# Altium project comp9.PrjPcb (part 1 of 2)
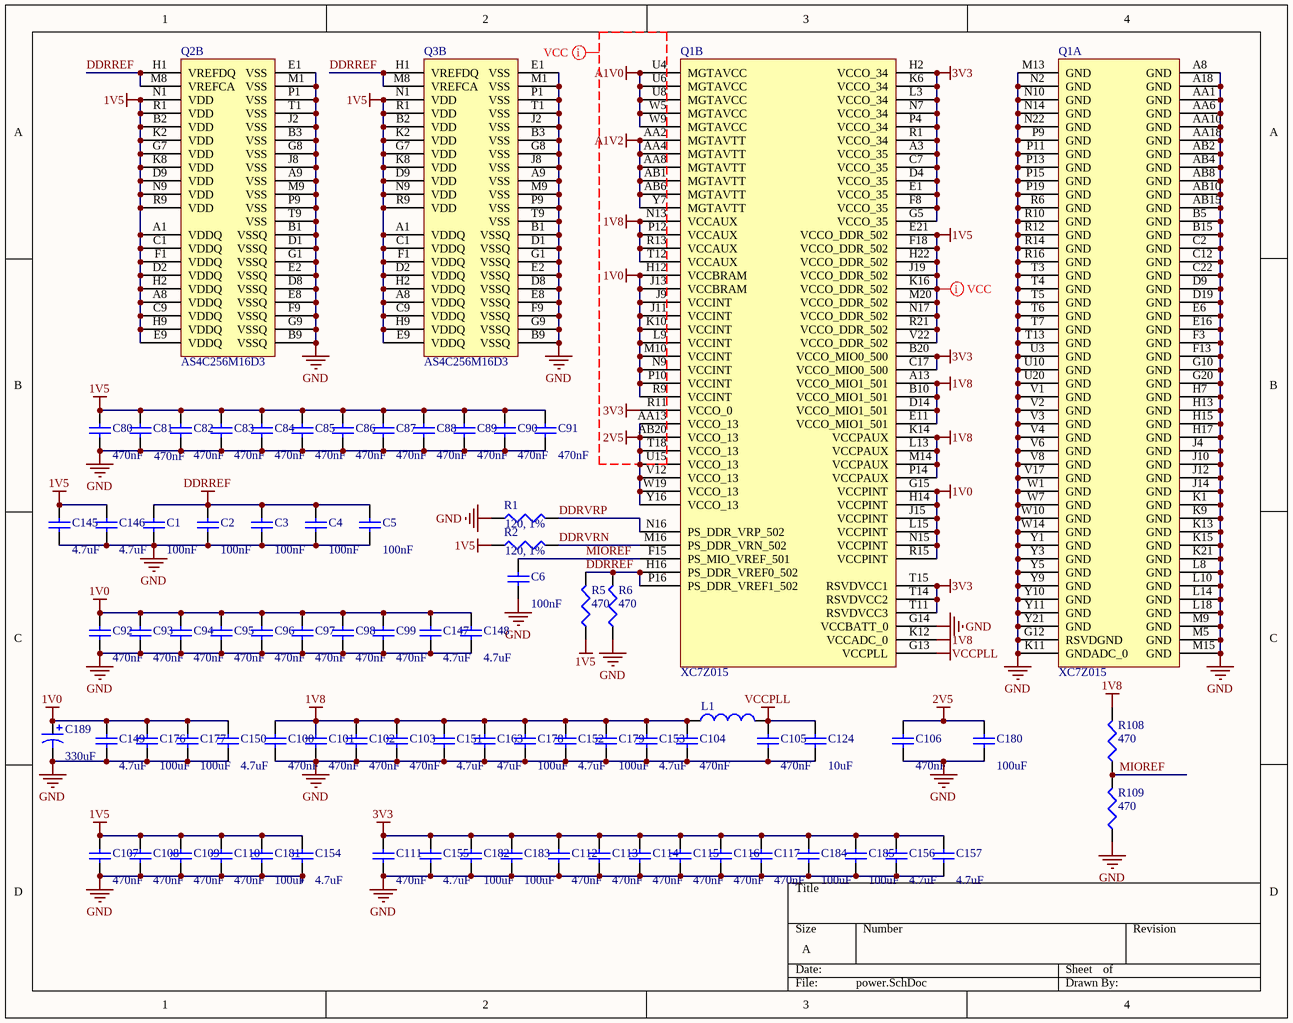
[diagram p0: power.SchDoc]
8 sheets, 479 parts. Net scope: global (net labels, ports and power ports of the same name join across sheets).
Board file: pcb.PcbDoc
Sheets:
  power.SchDoc
  misc.SchDoc
  mem.SchDoc
  conf.SchDoc
  ethusb.SchDoc
  gtp.SchDoc
  psu.SchDoc
  audio.SchDoc

## Sheet power.SchDoc
size A

### Parts
C1  value 100nF  [CAPC1005X06L]  (hidden comment: Cap)
C2  value 100nF  [CAPC1005X06L]  (hidden comment: Cap)
C3  value 100nF  [CAPC1005X06L]  (hidden comment: Cap)
C4  value 100nF  [CAPC1005X06L]  (hidden comment: Cap)
C5  value 100nF  [CAPC1005X06L]  (hidden comment: Cap)
C6  value 100nF  [CAPC1005X06L]  (hidden comment: Cap)
C80  value 470nF  [CAPC1005X06L]  (hidden comment: JMK105BJ474KV-F)
C81  value 470nF  [CAPC1005X06L]  (hidden comment: JMK105BJ474KV-F)
C82  value 470nF  [CAPC1005X06L]  (hidden comment: JMK105BJ474KV-F)
C83  value 470nF  [CAPC1005X06L]  (hidden comment: JMK105BJ474KV-F)
C84  value 470nF  [CAPC1005X06L]  (hidden comment: JMK105BJ474KV-F)
C85  value 470nF  [CAPC1005X06L]  (hidden comment: JMK105BJ474KV-F)
C86  value 470nF  [CAPC1005X06L]  (hidden comment: JMK105BJ474KV-F)
C87  value 470nF  [CAPC1005X06L]  (hidden comment: JMK105BJ474KV-F)
C88  value 470nF  [CAPC1005X06L]  (hidden comment: JMK105BJ474KV-F)
C89  value 470nF  [CAPC1005X06L]  (hidden comment: JMK105BJ474KV-F)
C90  value 470nF  [CAPC1005X06L]  (hidden comment: JMK105BJ474KV-F)
C91  value 470nF  [CAPC1005X06L]  (hidden comment: JMK105BJ474KV-F)
C92  value 470nF  [CAPC1005X06L]  (hidden comment: JMK105BJ474KV-F)
C93  value 470nF  [CAPC1005X06L]  (hidden comment: JMK105BJ474KV-F)
C94  value 470nF  [CAPC1005X06L]  (hidden comment: JMK105BJ474KV-F)
C95  value 470nF  [CAPC1005X06L]  (hidden comment: JMK105BJ474KV-F)
C96  value 470nF  [CAPC1005X06L]  (hidden comment: JMK105BJ474KV-F)
C97  value 470nF  [CAPC1005X06L]  (hidden comment: JMK105BJ474KV-F)
C98  value 470nF  [CAPC1005X06L]  (hidden comment: JMK105BJ474KV-F)
C99  value 470nF  [CAPC1005X06L]  (hidden comment: JMK105BJ474KV-F)
C100  value 470nF  [CAPC1005X06L]  (hidden comment: JMK105BJ474KV-F)
C101  value 470nF  [CAPC1005X06L]  (hidden comment: JMK105BJ474KV-F)
C102  value 470nF  [CAPC1005X06L]  (hidden comment: JMK105BJ474KV-F)
C103  value 470nF  [CAPC1005X06L]  (hidden comment: JMK105BJ474KV-F)
C104  value 470nF  [CAPC1005X06L]  (hidden comment: JMK105BJ474KV-F)
C105  value 470nF  [CAPC1005X06L]  (hidden comment: JMK105BJ474KV-F)
C106  value 470nF  [CAPC1005X06L]  (hidden comment: JMK105BJ474KV-F)
C107  value 470nF  [CAPC1005X06L]  (hidden comment: JMK105BJ474KV-F)
C108  value 470nF  [CAPC1005X06L]  (hidden comment: JMK105BJ474KV-F)
C109  value 470nF  [CAPC1005X06L]  (hidden comment: JMK105BJ474KV-F)
C110  value 470nF  [CAPC1005X06L]  (hidden comment: JMK105BJ474KV-F)
C111  value 470nF  [CAPC1005X06L]  (hidden comment: JMK105BJ474KV-F)
C112  value 470nF  [CAPC1005X06L]  (hidden comment: JMK105BJ474KV-F)
C113  value 470nF  [CAPC1005X06L]  (hidden comment: JMK105BJ474KV-F)
C114  value 470nF  [CAPC1005X06L]  (hidden comment: JMK105BJ474KV-F)
C115  value 470nF  [CAPC1005X06L]  (hidden comment: JMK105BJ474KV-F)
C116  value 470nF  [CAPC1005X06L]  (hidden comment: JMK105BJ474KV-F)
C117  value 470nF  [CAPC1005X06L]  (hidden comment: JMK105BJ474KV-F)
C124  value 10uF  [CAPC1608X90N]  (hidden comment: GRM188R60G106ME47)
C145  value 4.7uF  [CAPC1608X90N]  (hidden comment: GRM188R60J475ME19D)
C146  value 4.7uF  [CAPC1608X90N]  (hidden comment: GRM188R60J475ME19D)
C147  value 4.7uF  [CAPC1608X90N]  (hidden comment: GRM188R60J475ME19D)
C148  value 4.7uF  [CAPC1608X90N]  (hidden comment: GRM188R60J475ME19D)
C149  value 4.7uF  [CAPC1608X90N]  (hidden comment: GRM188R60J475ME19D)
C150  value 4.7uF  [CAPC1608X90N]  (hidden comment: GRM188R60J475ME19D)
C151  value 4.7uF  [CAPC1608X90N]  (hidden comment: GRM188R60J475ME19D)
C152  value 4.7uF  [CAPC1608X90N]  (hidden comment: GRM188R60J475ME19D)
C153  value 4.7uF  [CAPC1608X90N]  (hidden comment: GRM188R60J475ME19D)
C154  value 4.7uF  [CAPC1608X90N]  (hidden comment: GRM188R60J475ME19D)
C155  value 4.7uF  [CAPC1608X90N]  (hidden comment: GRM188R60J475ME19D)
C156  value 4.7uF  [CAPC1608X90N]  (hidden comment: GRM188R60J475ME19D)
C157  value 4.7uF  [CAPC1608X90N]  (hidden comment: GRM188R60J475ME19D)
C163  value 47uF  [CAPC3225X220N]  (hidden comment: GRM31CR60J476ME19L)
C176  value 100uF  [CAPC3225X220N]  (hidden comment: GRM31CR60J107ME39L)
C177  value 100uF  [CAPC3225X220N]  (hidden comment: GRM31CR60J107ME39L)
C178  value 100uF  [CAPC3225X220N]  (hidden comment: GRM31CR60J107ME39L)
C179  value 100uF  [CAPC3225X220N]  (hidden comment: GRM31CR60J107ME39L)
C180  value 100uF  [CAPC3225X220N]  (hidden comment: GRM31CR60J107ME39L)
C181  value 100uF  [CAPC3225X220N]  (hidden comment: GRM31CR60J107ME39L)
C182  value 100uF  [CAPC3225X220N]  (hidden comment: GRM31CR60J107ME39L)
C183  value 100uF  [CAPC3225X220N]  (hidden comment: GRM31CR60J107ME39L)
C184  value 100uF  [CAPC3225X220N]  (hidden comment: GRM31CR60J107ME39L)
C185  value 100uF  [CAPC3225X220N]  (hidden comment: GRM31CR60J107ME39L)
C189  value 330uF  [CAP-D/7343-31]  (hidden comment: T520D337M006ATE018)
L1  BLM18SG121TN1  [CAPC1608X90N]  (value not drawn)
Q1  XC7Z015  [BGA484x22]  (parts A,B of 9)
Q2  AS4C256M16D3  [DDR3]  (part B of 2)
Q3  AS4C256M16D3  [DDR3]  (part B of 2)
R1  value 120, 1%  [CAPC1005X06L]  (hidden comment: RC1005F121CS)
R2  value 120, 1%  [CAPC1005X06L]  (hidden comment: RC1005F121CS)
R5  value 470  [J1-0603]  (hidden comment: RC1608F471CS)
R6  value 470  [J1-0603]  (hidden comment: RC1608F471CS)
R108  value 470  [CAPC1005X06L]  (hidden comment: RC1005F471CS)
R109  value 470  [CAPC1005X06L]  (hidden comment: RC1005F471CS)

### Nets
1V0: C92.2 C93.2 C94.2 C95.2 C96.2 C97.2 C98.2 C99.2 C147.2 C148.2 C149.2 C150.2 C176.2 C177.2 C189.1 Q1.G15(VCCPINT) Q1.H12(VCCBRAM) Q1.H14(VCCPINT) Q1.J9(VCCINT) Q1.J11(VCCINT) Q1.J13(VCCBRAM) Q1.J15(VCCPINT) Q1.K10(VCCINT) Q1.L9(VCCINT) Q1.L15(VCCPINT) Q1.M10(VCCINT) Q1.N9(VCCINT) Q1.N15(VCCPINT) Q1.P10(VCCINT) Q1.R9(VCCINT) Q1.R15(VCCPINT)
1V5: C80.2 C81.2 C82.2 C83.2 C84.2 C85.2 C86.2 C87.2 C88.2 C89.2 C90.2 C91.2 C107.2 C108.2 C109.2 C110.2 C145.2 C146.2 C154.2 C181.2 Q1.E21(VCCO_DDR_502) Q1.F18(VCCO_DDR_502) Q1.H22(VCCO_DDR_502) Q1.J19(VCCO_DDR_502) Q1.K16(VCCO_DDR_502) Q1.M20(VCCO_DDR_502) Q1.N17(VCCO_DDR_502) Q1.R21(VCCO_DDR_502) Q1.V22(VCCO_DDR_502) Q2.A1(VDDQ) Q2.A8(VDDQ) Q2.B2(VDD) Q2.C1(VDDQ) Q2.C9(VDDQ) Q2.D2(VDDQ) Q2.D9(VDD) Q2.E9(VDDQ) Q2.F1(VDDQ) Q2.G7(VDD) Q2.H2(VDDQ) Q2.H9(VDDQ) Q2.K2(VDD) Q2.K8(VDD) Q2.N1(VDD) Q2.N9(VDD) Q2.R1(VDD) Q2.R9(VDD) Q3.A1(VDDQ) Q3.A8(VDDQ) Q3.B2(VDD) Q3.C1(VDDQ) Q3.C9(VDDQ) Q3.D2(VDDQ) Q3.D9(VDD) Q3.E9(VDDQ) Q3.F1(VDDQ) Q3.G7(VDD) Q3.H2(VDDQ) Q3.H9(VDDQ) Q3.K2(VDD) Q3.K8(VDD) Q3.N1(VDD) Q3.N9(VDD) Q3.R1(VDD) Q3.R9(VDD) R2.1 R5.1
1V8: C100.2 C101.2 C102.2 C103.2 C104.2 C151.2 C152.2 C153.2 C163.2 C178.2 C179.2 L1.1 Q1.A13(VCCO_MIO1_501) Q1.B10(VCCO_MIO1_501) Q1.D14(VCCO_MIO1_501) Q1.E11(VCCO_MIO1_501) Q1.K12(VCCADC_0) Q1.K14(VCCPAUX) Q1.L13(VCCPAUX) Q1.M14(VCCPAUX) Q1.N13(VCCAUX) Q1.P12(VCCAUX) Q1.P14(VCCPAUX) Q1.R13(VCCAUX) Q1.T12(VCCAUX) R108.2
2V5: C106.2 C180.2 Q1.AA13(VCCO_13) Q1.AB20(VCCO_13) Q1.T18(VCCO_13) Q1.U15(VCCO_13) Q1.V12(VCCO_13) Q1.W19(VCCO_13) Q1.Y16(VCCO_13)
3V3: C111.2 C112.2 C113.2 C114.2 C115.2 C116.2 C117.2 C155.2 C156.2 C157.2 C182.2 C183.2 C184.2 C185.2 Q1.A3(VCCO_35) Q1.B20(VCCO_MIO0_500) Q1.C7(VCCO_35) Q1.C17(VCCO_MIO0_500) Q1.D4(VCCO_35) Q1.E1(VCCO_35) Q1.F8(VCCO_35) Q1.G5(VCCO_35) Q1.H2(VCCO_34) Q1.K6(VCCO_34) Q1.L3(VCCO_34) Q1.N7(VCCO_34) Q1.P4(VCCO_34) Q1.R1(VCCO_34) Q1.R11(VCCO_0) Q1.T11(RSVDVCC3) Q1.T14(RSVDVCC2) Q1.T15(RSVDVCC1)
A1V0: Q1.U4(MGTAVCC) Q1.U6(MGTAVCC) Q1.U8(MGTAVCC) Q1.W5(MGTAVCC) Q1.W9(MGTAVCC)
A1V2: Q1.AA2(MGTAVTT) Q1.AA4(MGTAVTT) Q1.AA8(MGTAVTT) Q1.AB1(MGTAVTT) Q1.AB6(MGTAVTT) Q1.Y7(MGTAVTT)
DDRREF: C1.2 C2.2 C3.2 C4.2 C5.2 Q1.H16(PS_DDR_VREF0_502) Q1.P16(PS_DDR_VREF1_502) Q2.H1(VREFDQ) Q2.M8(VREFCA) Q3.H1(VREFDQ) Q3.M8(VREFCA) R5.2 R6.2
GND: C1.1 C2.1 C3.1 C4.1 C5.1 C6.1 C80.1 C81.1 C82.1 C83.1 C84.1 C85.1 C86.1 C87.1 C88.1 C89.1 C90.1 C91.1 C92.1 C93.1 C94.1 C95.1 C96.1 C97.1 C98.1 C99.1 C100.1 C101.1 C102.1 C103.1 C104.1 C105.1 C106.1 C107.1 C108.1 C109.1 C110.1 C111.1 C112.1 C113.1 C114.1 C115.1 C116.1 C117.1 C124.1 C145.1 C146.1 C147.1 C148.1 C149.1 C150.1 C151.1 C152.1 C153.1 C154.1 C155.1 C156.1 C157.1 C163.1 C176.1 C177.1 C178.1 C179.1 C180.1 C181.1 C182.1 C183.1 C184.1 C185.1 C189.2 Q1.A8(GND) Q1.A18(GND) Q1.AA1(GND) Q1.AA6(GND) Q1.AA10(GND) Q1.AA18(GND) Q1.AB2(GND) Q1.AB4(GND) Q1.AB8(GND) Q1.AB10(GND) Q1.AB15(GND) Q1.B5(GND) Q1.B15(GND) Q1.C2(GND) Q1.C12(GND) Q1.C22(GND) Q1.D9(GND) Q1.D19(GND) Q1.E6(GND) Q1.E16(GND) Q1.F3(GND) Q1.F13(GND) Q1.G10(GND) Q1.G12(RSVDGND) Q1.G14(VCCBATT_0) Q1.G20(GND) Q1.H7(GND) Q1.H13(GND) Q1.H15(GND) Q1.H17(GND) Q1.J4(GND) Q1.J10(GND) Q1.J12(GND) Q1.J14(GND) Q1.K1(GND) Q1.K9(GND) Q1.K11(GNDADC_0) Q1.K13(GND) Q1.K15(GND) Q1.K21(GND) Q1.L8(GND) Q1.L10(GND) Q1.L14(GND) Q1.L18(GND) Q1.M5(GND) Q1.M9(GND) Q1.M13(GND) Q1.M15(GND) Q1.N2(GND) Q1.N10(GND) Q1.N14(GND) Q1.N22(GND) Q1.P9(GND) Q1.P11(GND) Q1.P13(GND) Q1.P15(GND) Q1.P19(GND) Q1.R6(GND) Q1.R10(GND) Q1.R12(GND) Q1.R14(GND) Q1.R16(GND) Q1.T3(GND) Q1.T4(GND) Q1.T5(GND) Q1.T6(GND) Q1.T7(GND) Q1.T13(GND) Q1.U3(GND) Q1.U10(GND) Q1.U20(GND) Q1.V1(GND) Q1.V2(GND) Q1.V3(GND) Q1.V4(GND) Q1.V6(GND) Q1.V8(GND) Q1.V17(GND) Q1.W1(GND) Q1.W7(GND) Q1.W10(GND) Q1.W14(GND) Q1.Y1(GND) Q1.Y3(GND) Q1.Y5(GND) Q1.Y9(GND) Q1.Y10(GND) Q1.Y11(GND) Q1.Y21(GND) Q2.A9(VSS) Q2.B1(VSSQ) Q2.B3(VSS) Q2.B9(VSSQ) Q2.D1(VSSQ) Q2.D8(VSSQ) Q2.E1(VSS) Q2.E2(VSSQ) Q2.E8(VSSQ) Q2.F9(VSSQ) Q2.G1(VSSQ) Q2.G8(VSS) Q2.G9(VSSQ) Q2.J2(VSS) Q2.J8(VSS) Q2.M1(VSS) Q2.M9(VSS) Q2.P1(VSS) Q2.P9(VSS) Q2.T1(VSS) Q2.T9(VSS) Q3.A9(VSS) Q3.B1(VSSQ) Q3.B3(VSS) Q3.B9(VSSQ) Q3.D1(VSSQ) Q3.D8(VSSQ) Q3.E1(VSS) Q3.E2(VSSQ) Q3.E8(VSSQ) Q3.F9(VSSQ) Q3.G1(VSSQ) Q3.G8(VSS) Q3.G9(VSSQ) Q3.J2(VSS) Q3.J8(VSS) Q3.M1(VSS) Q3.M9(VSS) Q3.P1(VSS) Q3.P9(VSS) Q3.T1(VSS) Q3.T9(VSS) R1.1 R6.1 R109.1
VCCPLL: C105.2 C124.2 L1.2 Q1.G13(VCCPLL)
DDRVRN: Q1.M16(PS_DDR_VRN_502) R2.2
DDRVRP: Q1.N16(PS_DDR_VRP_502) R1.2
MIOREF: C6.2 Q1.F15(PS_MIO_VREF_501) R108.1 R109.2

### Layout directives
net class VCC: 1V0, 1V5, 1V8, 2V5, 3V3, A1V0, A1V2

### Library data of the parts
C1-C6 C80-C117 C124 C145-C157 C163 C176-C185 = Cap: Capacitor; Published: 8-Jun-2000; LatestRevisionDate: 17-Jul-2002; LatestRevisionNote: Re-released for DXP Platform.; PackageReference: RAD-0.3; Publisher: Altium Limited; PackageDescription: Radial Cap, Thru-Hole; 2 Leads; 0.3 in Pin Spacing; Supplier 1: Digi-Key
  C1-C6: Supplier Part Number 1: 1276-1443-1-ND
  C80-C117: Supplier Part Number 1: 587-1230-1-ND
  C124: Supplier Part Number 1: 490-3298-1-ND
  C145-C157: Supplier Part Number 1: 490-5421-1-ND
  C163: Supplier Part Number 1: 490-3907-1-ND
  C176-C185: Supplier Part Number 1: 490-4539-1-ND
C189 = Cap Pol1: Polarized Capacitor (Radial); Published: 8-Jun-2000; LatestRevisionDate: 17-Jul-2002; LatestRevisionNote: Re-released for DXP Platform.; PackageReference: RB7.6-15; Publisher: Altium Limited; PackageDescription: Polarized Capacitor (Radial); 2 Leads; Supplier 1: Digi-Key; Supplier Part Number 1: 399-5149-1-ND
L1 = Inductor: Code_IEC: 1005; Value: 10mH; Published: 8-Jun-2000; LatestRevisionDate: 29-May-2009; LatestRevisionNote: IPC-7351 Footprint Added.; PackageReference: 0402-A; Publisher: Altium Limited; PackageDescription: Chip Inductor; Code_JEITA: 0402; Supplier 1: Digi-Key; Supplier Part Number 1: 490-3996-1-ND
R1 R2 R5 R6 R108 R109 = Res3: Resistor; Published: 8-Jun-2000; LatestRevisionDate: 29-May-2009; LatestRevisionNote: IPC-7351 Footprint Added.; PackageReference: J1-0603; Publisher: Altium Limited; PackageDescription: Chip Resistor; Supplier 1: Digi-Key
  R1 R2: Supplier Part Number 1: 1276-3947-1-ND
  R5 R6: Supplier Part Number 1: 1276-4619-1-ND
  R108 R109: Supplier Part Number 1: 1276-3989-1-ND
Q1 = XC7Z015: Supplier 1: Digi-Key; Supplier Part Number 1: 122-1905-ND
Q2 Q3 = AS4C256M16D3: Supplier 1: Digi-Key; Supplier Part Number 1: 1450-1095-ND

## Sheet misc.SchDoc
size A
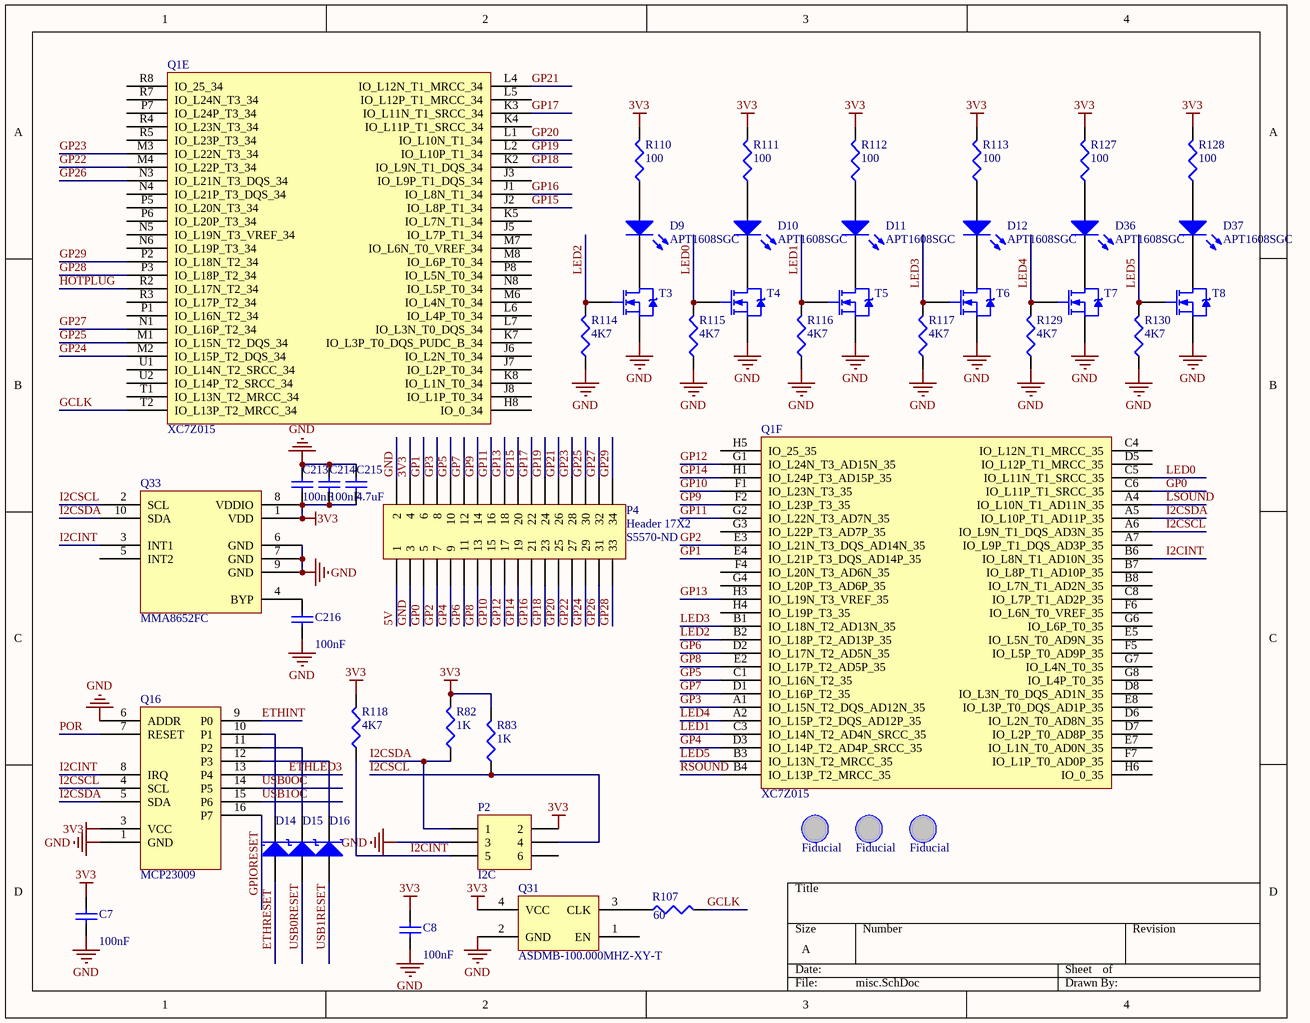
[diagram p1: misc.SchDoc]

### Parts
C7  value 100nF  [CAPC1005X06L]  (hidden comment: Cap)
C8  value 100nF  [CAPC1005X06L]  (hidden comment: Cap)
C213  value 100nF  [CAPC1005X06L]  (hidden comment: Cap)
C214  value 100nF  [CAPC1005X06L]  (hidden comment: Cap)
C215  value 4.7uF  [CAPC1608X90N]  (hidden comment: GRM188R60J475ME19D)
C216  value 100nF  [CAPC1005X06L]  (hidden comment: Cap)
D9  APT1608SGC  [LED-0603]
D10  APT1608SGC  [LED-0603]
D11  APT1608SGC  [LED-0603]
D12  APT1608SGC  [LED-0603]
D14  BAT54FSCT-ND  [BAT54]  (value not drawn)
D15  BAT54FSCT-ND  [BAT54]  (value not drawn)
D16  BAT54FSCT-ND  [BAT54]  (value not drawn)
D36  APT1608SGC  [LED-0603]
D37  APT1608SGC  [LED-0603]
FIDU1  Fiducial  [FIDU]  (no BOM)
FIDU2  Fiducial  [FIDU]  (no BOM)
FIDU3  Fiducial  [FIDU]  (no BOM)
P2  I2C  [HDR2X3]
P4  Header 17X2  Supplier Part Number 1: S5570-ND  [HDR2X17]
Q1  XC7Z015  [BGA484x22]  (parts E,F of 9)
Q16  MCP23009  [MCP23009]
Q31  ASDMB-100.000MHZ-XY-T  [ASDMB]
Q33  MMA8652FC  [MMA8653FC]
R82  value 1K  [J1-0603]  (hidden comment: RC1608J102CS)
R83  value 1K  [J1-0603]  (hidden comment: RC1608J102CS)
R107  value 60  [J1-0603]  (hidden comment: RC1608F60R4CS)
R110  value 100  [J1-0603]  (hidden comment: RC1608F101CS)
R111  value 100  [J1-0603]  (hidden comment: RC1608F101CS)
R112  value 100  [J1-0603]  (hidden comment: RC1608F101CS)
R113  value 100  [J1-0603]  (hidden comment: RC1608F101CS)
R114  value 4K7  [J1-0603]  (hidden comment: RC1608J472CS)
R115  value 4K7  [J1-0603]  (hidden comment: RC1608J472CS)
R116  value 4K7  [J1-0603]  (hidden comment: RC1608J472CS)
R117  value 4K7  [J1-0603]  (hidden comment: RC1608J472CS)
R118  value 4K7  [J1-0603]  (hidden comment: RC1608J472CS)
R127  value 100  [J1-0603]  (hidden comment: RC1608F101CS)
R128  value 100  [J1-0603]  (hidden comment: RC1608F101CS)
R129  value 4K7  [J1-0603]  (hidden comment: RC1608J472CS)
R130  value 4K7  [J1-0603]  (hidden comment: RC1608J472CS)
T3  (no value)  [EMT3F]
T4  (no value)  [EMT3F]
T5  (no value)  [EMT3F]
T6  (no value)  [EMT3F]
T7  (no value)  [EMT3F]
T8  (no value)  [EMT3F]

### Nets
3V3: C7.2 C8.2 C213.2 C214.1 C215.1 P2.2 P4.4 Q16.3(VCC) Q31.4(VCC) Q33.1(VDD) Q33.8(VDDIO) R82.2 R83.2 R110.2 R111.2 R112.2 R113.2 R118.2 R127.2 R128.2
5V: P4.1
GND: C7.1 C8.1 C213.1 C214.2 C215.2 C216.1 P2.3 P4.2 P4.3 Q16.1(GND) Q16.6(ADDR) Q31.2(GND) Q33.6(GND) Q33.7(GND) Q33.9(GND) R114.1 R115.1 R116.1 R117.1 R129.1 R130.1 T3.2(S) T4.2(S) T5.2(S) T6.2(S) T7.2(S) T8.2(S)
ETHINT: Q16.9(P0)
ETHLED3: Q16.13(P4)
ETHRESET: D14.1(A)
GCLK: Q1.T2(IO_L13P_T2_MRCC_34) R107.2
GP0: P4.5 Q1.C6(IO_L11P_T1_SRCC_35)
GP1: P4.6 Q1.E4(IO_L21P_T3_DQS_AD14P_35)
GP2: P4.7 Q1.E3(IO_L21N_T3_DQS_AD14N_35)
GP3: P4.8 Q1.A1(IO_L15N_T2_DQS_AD12N_35)
GP4: P4.9 Q1.D3(IO_L14P_T2_AD4P_SRCC_35)
GP5: P4.10 Q1.C1(IO_L16N_T2_35)
GP6: P4.11 Q1.D2(IO_L17N_T2_AD5N_35)
GP7: P4.12 Q1.D1(IO_L16P_T2_35)
GP8: P4.13 Q1.E2(IO_L17P_T2_AD5P_35)
GP9: P4.14 Q1.F2(IO_L23P_T3_35)
GP10: P4.15 Q1.F1(IO_L23N_T3_35)
GP11: P4.16 Q1.G2(IO_L22N_T3_AD7N_35)
GP12: P4.17 Q1.G1(IO_L24N_T3_AD15N_35)
GP13: P4.18 Q1.H3(IO_L19N_T3_VREF_35)
GP14: P4.19 Q1.H1(IO_L24P_T3_AD15P_35)
GP15: P4.20 Q1.J2(IO_L8P_T1_34)
GP16: P4.21 Q1.J1(IO_L8N_T1_34)
GP17: P4.22 Q1.K3(IO_L11N_T1_SRCC_34)
GP18: P4.23 Q1.K2(IO_L9N_T1_DQS_34)
GP19: P4.24 Q1.L2(IO_L10P_T1_34)
GP20: P4.25 Q1.L1(IO_L10N_T1_34)
GP21: P4.26 Q1.L4(IO_L12N_T1_MRCC_34)
GP22: P4.27 Q1.M4(IO_L22P_T3_34)
GP23: P4.28 Q1.M3(IO_L22N_T3_34)
GP24: P4.29 Q1.M2(IO_L15P_T2_DQS_34)
GP25: P4.30 Q1.M1(IO_L15N_T2_DQS_34)
GP26: P4.31 Q1.N3(IO_L21N_T3_DQS_34)
GP27: P4.32 Q1.N1(IO_L16P_T2_34)
GP28: P4.33 Q1.P3(IO_L18P_T2_34)
GP29: P4.34 Q1.P2(IO_L18N_T2_34)
GPIORESET: Q16.16(P7)
HOTPLUG: Q1.R2(IO_L17N_T2_34)
I2CINT: P2.5 Q1.B6(IO_L8N_T1_AD10N_35) Q16.8(IRQ) Q33.3(INT1) R118.1
I2CSCL: P2.4 Q1.A6(IO_L9N_T1_DQS_AD3N_35) Q16.4(SCL) Q33.2(SCL) R83.1
I2CSDA: P2.1 Q1.A5(IO_L10P_T1_AD11P_35) Q16.5(SDA) Q33.10(SDA) R82.1
LED0: Q1.C5(IO_L11N_T1_SRCC_35) R115.2 T4.1(G)
LED1: Q1.C3(IO_L14N_T2_AD4N_SRCC_35) R116.2 T5.1(G)
LED2: Q1.B2(IO_L18P_T2_AD13P_35) R114.2 T3.1(G)
LED3: Q1.B1(IO_L18N_T2_AD13N_35) R117.2 T6.1(G)
LED4: Q1.A2(IO_L15P_T2_DQS_AD12P_35) R129.2 T7.1(G)
LED5: Q1.B3(IO_L13N_T2_MRCC_35) R130.2 T8.1(G)
LSOUND: Q1.A4(IO_L10N_T1_AD11N_35)
POR: Q16.7(RESET)
RSOUND: Q1.B4(IO_L13P_T2_MRCC_35)
USB0OC: Q16.14(P5)
USB0RESET: D15.1(A)
USB1OC: Q16.15(P6)
USB1RESET: D16.1(A)
NetC216_2: C216.2 Q33.4(BYP)
NetD9_A: D9.A R110.1
NetD9_K: D9.K T3.3(D)
NetD10_A: D10.A R111.1
NetD10_K: D10.K T4.3(D)
NetD11_A: D11.A R112.1
NetD11_K: D11.K T5.3(D)
NetD12_A: D12.A R113.1
NetD12_K: D12.K T6.3(D)
NetD14_2: D14.2(K) Q16.10(P1)
NetD15_2: D15.2(K) Q16.11(P2)
NetD16_2: D16.2(K) Q16.12(P3)
NetD36_A: D36.A R127.1
NetD36_K: D36.K T7.3(D)
NetD37_A: D37.A R128.1
NetD37_K: D37.K T8.3(D)
NetQ31_3: Q31.3(CLK) R107.1

Not connected (* = marked no-connect by the designer): P2 6; Q1 A7(IO_L9P_T1_DQS_AD3P_35) B7(IO_L8P_T1_AD10P_35) B8(IO_L7N_T1_AD2N_35) C4(IO_L12N_T1_MRCC_35) C8(IO_L7P_T1_AD2P_35) D5(IO_L12P_T1_MRCC_35) D6(IO_L2N_T0_AD8N_35) D7(IO_L2P_T0_AD8P_35) D8(IO_L3N_T0_DQS_AD1N_35) E5(IO_L5N_T0_AD9N_35) E7(IO_L1N_T0_AD0N_35) E8(IO_L3P_T0_DQS_AD1P_35) F4(IO_L20N_T3_AD6N_35) F5(IO_L5P_T0_AD9P_35) F6(IO_L6N_T0_VREF_35) F7(IO_L1P_T0_AD0P_35) G3(IO_L22P_T3_AD7P_35) G4(IO_L20P_T3_AD6P_35) G6(IO_L6P_T0_35) G7(IO_L4N_T0_35) G8(IO_L4P_T0_35) H4(IO_L19P_T3_35) H5(IO_25_35) H6(IO_0_35) H8(IO_0_34) J3(IO_L9P_T1_DQS_34) J5(IO_L7P_T1_34) J6(IO_L2N_T0_34) J7(IO_L2P_T0_34) J8(IO_L1P_T0_34) K4(IO_L11P_T1_SRCC_34) K5(IO_L7N_T1_34) K7(IO_L3P_T0_DQS_PUDC_B_34) K8(IO_L1N_T0_34) L5(IO_L12P_T1_MRCC_34) L6(IO_L4P_T0_34) L7(IO_L3N_T0_DQS_34) M6(IO_L4N_T0_34) M7(IO_L6N_T0_VREF_34) M8(IO_L6P_T0_34) N4(IO_L21P_T3_DQS_34) N5(IO_L19N_T3_VREF_34) N6(IO_L19P_T3_34) N8(IO_L5P_T0_34) P1(IO_L16N_T2_34) P5(IO_L20N_T3_34) P6(IO_L20P_T3_34) P7(IO_L24P_T3_34) P8(IO_L5N_T0_34) R3(IO_L17P_T2_34) R4(IO_L23N_T3_34) R5(IO_L23P_T3_34) R7(IO_L24N_T3_34) R8(IO_25_34) T1(IO_L13N_T2_MRCC_34) U1(IO_L14N_T2_SRCC_34) U2(IO_L14P_T2_SRCC_34); Q31 1(EN); Q33 5(INT2)

### Library data of the parts
C7 C8 C213-C216 = Cap: Capacitor; Published: 8-Jun-2000; LatestRevisionDate: 17-Jul-2002; LatestRevisionNote: Re-released for DXP Platform.; PackageReference: RAD-0.3; Publisher: Altium Limited; PackageDescription: Radial Cap, Thru-Hole; 2 Leads; 0.3 in Pin Spacing; Supplier 1: Digi-Key
  C7 C8 C213 C214 C216: Supplier Part Number 1: 1276-1443-1-ND
  C215: Supplier Part Number 1: 490-5421-1-ND
D9-D12 D36 D37 = LED2: Typical RED, GREEN, YELLOW, AMBER GaAs LED; Published: 8-Jun-2000; LatestRevisionDate: 17-Jul-2002; LatestRevisionNote: Re-released for DXP Platform.; PackageVersion: Feb-2002; PackageReference: 3.2X1.6X1.1; Publisher: Altium Limited; PackageDescription: SM LED; 2 Flat Leads; Supplier 1: Digi-Key; Supplier Part Number 1: 754-1121-1-ND
D14-D16 = D Schottky: Schottky Diode; Published: 8-Jun-2000; LatestRevisionDate: 17-Jul-2002; LatestRevisionNote: Re-released for DXP Platform.; PackageReference: SMB; Publisher: Altium Limited; PackageDescription: DO-214-AA/SMB; 2 C-Bend Leads; Body 5.3 x 3.6 mm, inc. leads (LxW); Code_JEDEC: DO-214-AA; Supplier 1: Digi-Key; Supplier Part Number 1: BAT54FSCT-ND
FIDU1-FIDU3 = FIDU
P2 = Header 3X2: Header, 3-Pin, Dual row; LatestRevisionDate: 17-Jul-2002; LatestRevisionNote: Re-released for DXP Platform.; Publisher: Altium Limited
P4 = Header 17X2: Header, 17-Pin, Dual row; LatestRevisionDate: 17-Jul-2002; LatestRevisionNote: Re-released for DXP Platform.; Publisher: Altium Limited; Supplier 1: Digi-Key
Q31 = osc: Supplier 1: Digi-Key; Supplier Part Number 1: 535-11147-1-ND
R82 R83 R107 R110-R118 R127-R130 = Res3: Resistor; Published: 8-Jun-2000; LatestRevisionDate: 29-May-2009; LatestRevisionNote: IPC-7351 Footprint Added.; PackageReference: J1-0603; PackageDescription: Chip Resistor; Supplier 1: Digi-Key
  R82 R83: Publisher: Altium Limited; Supplier Part Number 1: 1276-5062-1-ND
  R107: Supplier Part Number 1: 1276-4547-1-ND
  R110-R113 R127 R128: Supplier Part Number 1: 1276-3482-1-ND
  R114-R118 R129 R130: Supplier Part Number 1: 1276-5078-1-ND
T3-T8 = NMOS-2: N-Channel Power MOSFET; Note: Pin 2 is electrically connected to pin 4.; Published: 8-Jun-2000; LatestRevisionDate: 17-Jul-2002; LatestRevisionNote: Re-released for DXP Platform.; DatasheetVersion: PD-9.814; PackageVersion: Feb-1997; PackageReference: TO-220AB; Publisher: Altium Limited; PackageDescription: TO, Thru-Hole, Vertical, Heatsink Mounted; 3 In-Line Leads; Pitch 2.54 mm; ComponentLink1Description: Manufacturer Link; ComponentLink1URL: http://www.irf.com/; Supplier 1: Digi-Key; Supplier Part Number 1: RE1C002UNTCLDKR-ND
Q1 = XC7Z015: Supplier 1: Digi-Key; Supplier Part Number 1: 122-1905-ND
Q16 = MCP23009: Supplier 1: Digi-Key; Supplier Part Number 1: MCP23009-E/MG-ND
Q33 = MMA8652FC: Supplier 1: Digi-Key; Supplier Part Number 1: MMA8652FCR1CT-ND

## Sheet mem.SchDoc
size A
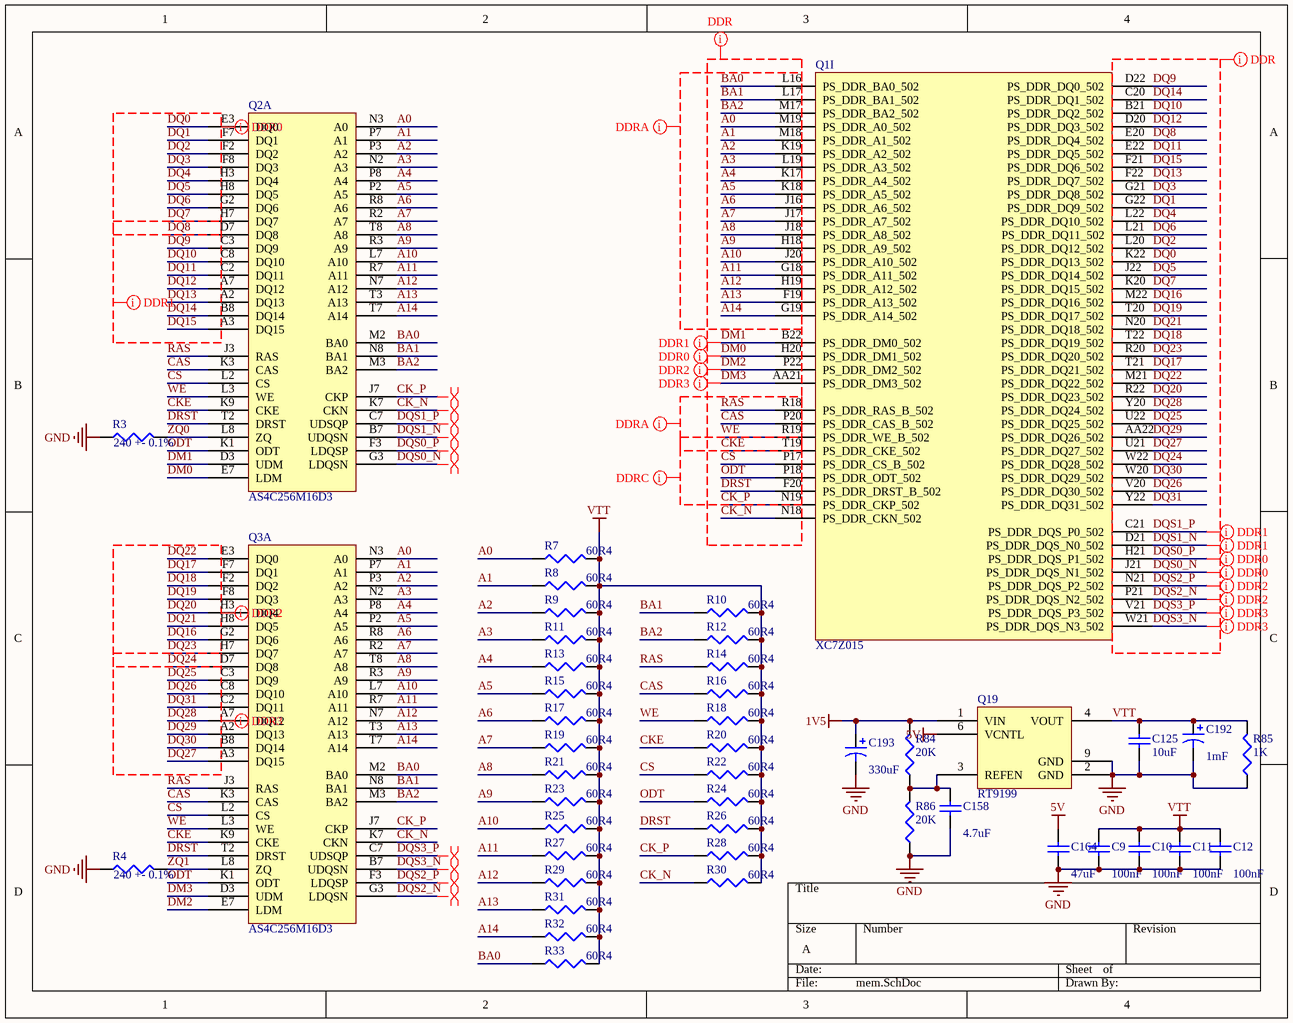
[diagram p2: mem.SchDoc]

### Parts
C9  value 100nF  [CAPC1005X06L]  (hidden comment: Cap)
C10  value 100nF  [CAPC1005X06L]  (hidden comment: Cap)
C11  value 100nF  [CAPC1005X06L]  (hidden comment: Cap)
C12  value 100nF  [CAPC1005X06L]  (hidden comment: Cap)
C125  value 10uF  [CAPC1608X90N]  (hidden comment: GRM188R60G106ME47)
C158  value 4.7uF  [CAPC1608X90N]  (hidden comment: GRM188R60J475ME19D)
C164  value 47uF  [CAPC3225X220N]  (hidden comment: GRM31CR60J476ME19L)
C192  value 1mF  [CAP-D/7343-31]  (hidden comment: TR3E108M004C0100)
C193  value 330uF  [CAP-D/7343-31]  (hidden comment: T520D337M006ATE018)
Q1  XC7Z015  [BGA484x22]  (part I of 9)
Q2  AS4C256M16D3  [DDR3]  (part A of 2)
Q3  AS4C256M16D3  [DDR3]  (part A of 2)
Q19  RT9199  [SOIC127P600X135_HS-9N]
R3  value 240 +- 0.1%  [J1-0603]  (hidden comment: RG1608P-241-B-T5)
R4  value 240 +- 0.1%  [J1-0603]  (hidden comment: RG1608P-241-B-T5)
R7  value 60R4  [CAPC1005X06L]  (hidden comment: RC1005F60R4CS)
R8  value 60R4  [CAPC1005X06L]  (hidden comment: RC1005F60R4CS)
R9  value 60R4  [CAPC1005X06L]  (hidden comment: RC1005F60R4CS)
R10  value 60R4  [CAPC1005X06L]  (hidden comment: RC1005F60R4CS)
R11  value 60R4  [CAPC1005X06L]  (hidden comment: RC1005F60R4CS)
R12  value 60R4  [CAPC1005X06L]  (hidden comment: RC1005F60R4CS)
R13  value 60R4  [CAPC1005X06L]  (hidden comment: RC1005F60R4CS)
R14  value 60R4  [CAPC1005X06L]  (hidden comment: RC1005F60R4CS)
R15  value 60R4  [CAPC1005X06L]  (hidden comment: RC1005F60R4CS)
R16  value 60R4  [CAPC1005X06L]  (hidden comment: RC1005F60R4CS)
R17  value 60R4  [CAPC1005X06L]  (hidden comment: RC1005F60R4CS)
R18  value 60R4  [CAPC1005X06L]  (hidden comment: RC1005F60R4CS)
R19  value 60R4  [CAPC1005X06L]  (hidden comment: RC1005F60R4CS)
R20  value 60R4  [CAPC1005X06L]  (hidden comment: RC1005F60R4CS)
R21  value 60R4  [CAPC1005X06L]  (hidden comment: RC1005F60R4CS)
R22  value 60R4  [CAPC1005X06L]  (hidden comment: RC1005F60R4CS)
R23  value 60R4  [CAPC1005X06L]  (hidden comment: RC1005F60R4CS)
R24  value 60R4  [CAPC1005X06L]  (hidden comment: RC1005F60R4CS)
R25  value 60R4  [CAPC1005X06L]  (hidden comment: RC1005F60R4CS)
R26  value 60R4  [CAPC1005X06L]  (hidden comment: RC1005F60R4CS)
R27  value 60R4  [CAPC1005X06L]  (hidden comment: RC1005F60R4CS)
R28  value 60R4  [CAPC1005X06L]  (hidden comment: RC1005F60R4CS)
R29  value 60R4  [CAPC1005X06L]  (hidden comment: RC1005F60R4CS)
R30  value 60R4  [CAPC1005X06L]  (hidden comment: RC1005F60R4CS)
R31  value 60R4  [CAPC1005X06L]  (hidden comment: RC1005F60R4CS)
R32  value 60R4  [CAPC1005X06L]  (hidden comment: RC1005F60R4CS)
R33  value 60R4  [CAPC1005X06L]  (hidden comment: RC1005F60R4CS)
R84  value 20K  [J1-0603]  (hidden comment: RC1608F203CS)
R85  value 1K  [J1-0603]  (hidden comment: RC1608J102CS)
R86  value 20K  [J1-0603]  (hidden comment: RC1608F203CS)

### Nets
1V5: C193.1 Q19.1(VIN) R84.2
5V: C164.2 Q19.6(VCNTL)
GND: C9.1 C10.1 C11.1 C12.1 C125.2 C158.1 C164.1 C192.2 C193.2 Q19.2(GND) Q19.9(GND) R3.1 R4.1 R85.1 R86.1
VTT: C9.2 C10.2 C11.2 C12.2 C125.1 C192.1 Q19.4(VOUT) R7.2 R8.2 R9.2 R10.2 R11.2 R12.2 R13.2 R14.2 R15.2 R16.2 R17.2 R18.2 R19.2 R20.2 R21.2 R22.2 R23.2 R24.2 R25.2 R26.2 R27.2 R28.2 R29.2 R30.2 R31.2 R32.2 R33.2 R85.2
A0: Q1.M19(PS_DDR_A0_502) Q2.N3(A0) Q3.N3(A0) R7.1
A1: Q1.M18(PS_DDR_A1_502) Q2.P7(A1) Q3.P7(A1) R8.1
A2: Q1.K19(PS_DDR_A2_502) Q2.P3(A2) Q3.P3(A2) R9.1
A3: Q1.L19(PS_DDR_A3_502) Q2.N2(A3) Q3.N2(A3) R11.1
A4: Q1.K17(PS_DDR_A4_502) Q2.P8(A4) Q3.P8(A4) R13.1
A5: Q1.K18(PS_DDR_A5_502) Q2.P2(A5) Q3.P2(A5) R15.1
A6: Q1.J16(PS_DDR_A6_502) Q2.R8(A6) Q3.R8(A6) R17.1
A7: Q1.J17(PS_DDR_A7_502) Q2.R2(A7) Q3.R2(A7) R19.1
A8: Q1.J18(PS_DDR_A8_502) Q2.T8(A8) Q3.T8(A8) R21.1
A9: Q1.H18(PS_DDR_A9_502) Q2.R3(A9) Q3.R3(A9) R23.1
A10: Q1.J20(PS_DDR_A10_502) Q2.L7(A10) Q3.L7(A10) R25.1
A11: Q1.G18(PS_DDR_A11_502) Q2.R7(A11) Q3.R7(A11) R27.1
A12: Q1.H19(PS_DDR_A12_502) Q2.N7(A12) Q3.N7(A12) R29.1
A13: Q1.F19(PS_DDR_A13_502) Q2.T3(A13) Q3.T3(A13) R31.1
A14: Q1.G19(PS_DDR_A14_502) Q2.T7(A14) Q3.T7(A14) R32.1
BA0: Q1.L16(PS_DDR_BA0_502) Q2.M2(BA0) Q3.M2(BA0) R33.1
BA1: Q1.L17(PS_DDR_BA1_502) Q2.N8(BA1) Q3.N8(BA1) R10.1
BA2: Q1.M17(PS_DDR_BA2_502) Q2.M3(BA2) Q3.M3(BA2) R12.1
CAS: Q1.P20(PS_DDR_CAS_B_502) Q2.K3(CAS) Q3.K3(CAS) R16.1
CK_N: Q1.N18(PS_DDR_CKN_502) Q2.K7(CKN) Q3.K7(CKN) R30.1
CK_P: Q1.N19(PS_DDR_CKP_502) Q2.J7(CKP) Q3.J7(CKP) R28.1
CKE: Q1.T19(PS_DDR_CKE_502) Q2.K9(CKE) Q3.K9(CKE) R20.1
CS: Q1.P17(PS_DDR_CS_B_502) Q2.L2(CS) Q3.L2(CS) R22.1
DM0: Q1.H20(PS_DDR_DM1_502) Q2.E7(LDM)
DM1: Q1.B22(PS_DDR_DM0_502) Q2.D3(UDM)
DM2: Q1.P22(PS_DDR_DM2_502) Q3.E7(LDM)
DM3: Q1.AA21(PS_DDR_DM3_502) Q3.D3(UDM)
DQ0: Q1.K22(PS_DDR_DQ13_502) Q2.E3(DQ0)
DQ1: Q1.G22(PS_DDR_DQ9_502) Q2.F7(DQ1)
DQ2: Q1.L20(PS_DDR_DQ12_502) Q2.F2(DQ2)
DQ3: Q1.G21(PS_DDR_DQ8_502) Q2.F8(DQ3)
DQ4: Q1.L22(PS_DDR_DQ10_502) Q2.H3(DQ4)
DQ5: Q1.J22(PS_DDR_DQ14_502) Q2.H8(DQ5)
DQ6: Q1.L21(PS_DDR_DQ11_502) Q2.G2(DQ6)
DQ7: Q1.K20(PS_DDR_DQ15_502) Q2.H7(DQ7)
DQ8: Q1.E20(PS_DDR_DQ4_502) Q2.D7(DQ8)
DQ9: Q1.D22(PS_DDR_DQ0_502) Q2.C3(DQ9)
DQ10: Q1.B21(PS_DDR_DQ2_502) Q2.C8(DQ10)
DQ11: Q1.E22(PS_DDR_DQ5_502) Q2.C2(DQ11)
DQ12: Q1.D20(PS_DDR_DQ3_502) Q2.A7(DQ12)
DQ13: Q1.F22(PS_DDR_DQ7_502) Q2.A2(DQ13)
DQ14: Q1.C20(PS_DDR_DQ1_502) Q2.B8(DQ14)
DQ15: Q1.F21(PS_DDR_DQ6_502) Q2.A3(DQ15)
DQ16: Q1.M22(PS_DDR_DQ16_502) Q3.G2(DQ6)
DQ17: Q1.T21(PS_DDR_DQ21_502) Q3.F7(DQ1)
DQ18: Q1.T22(PS_DDR_DQ19_502) Q3.F2(DQ2)
DQ19: Q1.T20(PS_DDR_DQ17_502) Q3.F8(DQ3)
DQ20: Q1.R22(PS_DDR_DQ23_502) Q3.H3(DQ4)
DQ21: Q1.N20(PS_DDR_DQ18_502) Q3.H8(DQ5)
DQ22: Q1.M21(PS_DDR_DQ22_502) Q3.E3(DQ0)
DQ23: Q1.R20(PS_DDR_DQ20_502) Q3.H7(DQ7)
DQ24: Q1.W22(PS_DDR_DQ28_502) Q3.D7(DQ8)
DQ25: Q1.U22(PS_DDR_DQ25_502) Q3.C3(DQ9)
DQ26: Q1.V20(PS_DDR_DQ30_502) Q3.C8(DQ10)
DQ27: Q1.U21(PS_DDR_DQ27_502) Q3.A3(DQ15)
DQ28: Q1.Y20(PS_DDR_DQ24_502) Q3.A7(DQ12)
DQ29: Q1.AA22(PS_DDR_DQ26_502) Q3.A2(DQ13)
DQ30: Q1.W20(PS_DDR_DQ29_502) Q3.B8(DQ14)
DQ31: Q1.Y22(PS_DDR_DQ31_502) Q3.C2(DQ11)
DQS0_N: Q1.J21(PS_DDR_DQS_N1_502) Q2.G3(LDQSN)
DQS0_P: Q1.H21(PS_DDR_DQS_P1_502) Q2.F3(LDQSP)
DQS1_N: Q1.D21(PS_DDR_DQS_N0_502) Q2.B7(UDQSN)
DQS1_P: Q1.C21(PS_DDR_DQS_P0_502) Q2.C7(UDSQP)
DQS2_N: Q1.P21(PS_DDR_DQS_N2_502) Q3.G3(LDQSN)
DQS2_P: Q1.N21(PS_DDR_DQS_P2_502) Q3.F3(LDQSP)
DQS3_N: Q1.W21(PS_DDR_DQS_N3_502) Q3.B7(UDQSN)
DQS3_P: Q1.V21(PS_DDR_DQS_P3_502) Q3.C7(UDSQP)
DRST: Q1.F20(PS_DDR_DRST_B_502) Q2.T2(DRST) Q3.T2(DRST) R26.1
ODT: Q1.P18(PS_DDR_ODT_502) Q2.K1(ODT) Q3.K1(ODT) R24.1
RAS: Q1.R18(PS_DDR_RAS_B_502) Q2.J3(RAS) Q3.J3(RAS) R14.1
WE: Q1.R19(PS_DDR_WE_B_502) Q2.L3(WE) Q3.L3(WE) R18.1
ZQ0: Q2.L8(ZQ) R3.2
ZQ1: Q3.L8(ZQ) R4.2
NetC158_2: C158.2 Q19.3(REFEN) R84.1 R86.2

### Layout directives
net class DDR: A0, A1, A2, A3, A4, A5, A6, A7, A8, A9, A10, A11, A12, A13, A14, BA0, BA1, BA2, CAS, CK_N, CK_P, CKE, CS, DM0, DM1, DM2, DM3, DQ0, DQ1, DQ2, DQ3, DQ4, DQ5, DQ6, DQ7, DQ8, DQ9, DQ10, DQ11, DQ12, DQ13, DQ14, DQ15, DQ16, DQ17, DQ18, DQ19, DQ20, DQ21, DQ22, DQ23, DQ24, DQ25, DQ26, DQ27, DQ28, DQ29, DQ30, DQ31, DQS0_N, DQS0_P, DQS1_N, DQS1_P, DQS2_N, DQS2_P, DQS3_N, DQS3_P, DRST, ODT, RAS, WE
differential pair: CK_N, CK_P, DQS0_N, DQS0_P, DQS1_N, DQS1_P, DQS2_N, DQS2_P, DQS3_N, DQS3_P
net class DDR0: DM0, DQ0, DQ1, DQ2, DQ3, DQ4, DQ5, DQ6, DQ7, DQ8, DQS0_N, DQS0_P
net class DDR3: DM3, DQ23, DQ24, DQ25, DQ26, DQ27, DQ28, DQ29, DQ30, DQ31, DQS3_N, DQS3_P
net class DDR2: DM2, DQ16, DQ17, DQ18, DQ19, DQ20, DQ21, DQ22, DQ23, DQ24, DQS2_N, DQS2_P
net class DDR1: DM1, DQ7, DQ8, DQ9, DQ10, DQ11, DQ12, DQ13, DQ14, DQ15, DQS1_N, DQS1_P
net class DDRA: A0, A1, A2, A3, A4, A5, A6, A7, A8, A9, A10, A11, A12, A13, A14, BA0, BA1, BA2, CAS, CKE, RAS, WE
net class DDRC: CK_P, CKE, CS, DRST, ODT, WE

### Library data of the parts
C9-C12 C125 C158 C164 = Cap: Capacitor; Published: 8-Jun-2000; LatestRevisionDate: 17-Jul-2002; LatestRevisionNote: Re-released for DXP Platform.; PackageReference: RAD-0.3; Publisher: Altium Limited; PackageDescription: Radial Cap, Thru-Hole; 2 Leads; 0.3 in Pin Spacing; Supplier 1: Digi-Key
  C9-C12: Supplier Part Number 1: 1276-1443-1-ND
  C125: Supplier Part Number 1: 490-3298-1-ND
  C158: Supplier Part Number 1: 490-5421-1-ND
  C164: Supplier Part Number 1: 490-3907-1-ND
C192 C193 = Cap Pol1: Polarized Capacitor (Radial); Published: 8-Jun-2000; LatestRevisionDate: 17-Jul-2002; LatestRevisionNote: Re-released for DXP Platform.; PackageReference: RB7.6-15; Publisher: Altium Limited; PackageDescription: Polarized Capacitor (Radial); 2 Leads; Supplier 1: Digi-Key
  C192: Supplier Part Number 1: 718-1452-1-ND
  C193: Supplier Part Number 1: 399-5149-1-ND
R3 R4 R7-R33 R84-R86 = Res3: Resistor; Published: 8-Jun-2000; LatestRevisionDate: 29-May-2009; LatestRevisionNote: IPC-7351 Footprint Added.; PackageReference: J1-0603; Publisher: Altium Limited; PackageDescription: Chip Resistor; Supplier 1: Digi-Key
  R3 R4: Supplier Part Number 1: RG16P240BCT-ND
  R7-R33: Supplier Part Number 1: 1276-3929-1-ND
  R84 R86: Supplier Part Number 1: 1276-4768-1-ND
  R85: Supplier Part Number 1: 1276-5062-1-ND
Q1 = XC7Z015: Supplier 1: Digi-Key; Supplier Part Number 1: 122-1905-ND
Q2 Q3 = AS4C256M16D3: Supplier 1: Digi-Key; Supplier Part Number 1: 1450-1095-ND
Q19 = RT9199: Supplier 1: Digi-Key; Supplier Part Number 1: 1028-1075-1-ND

## Sheet conf.SchDoc
size A
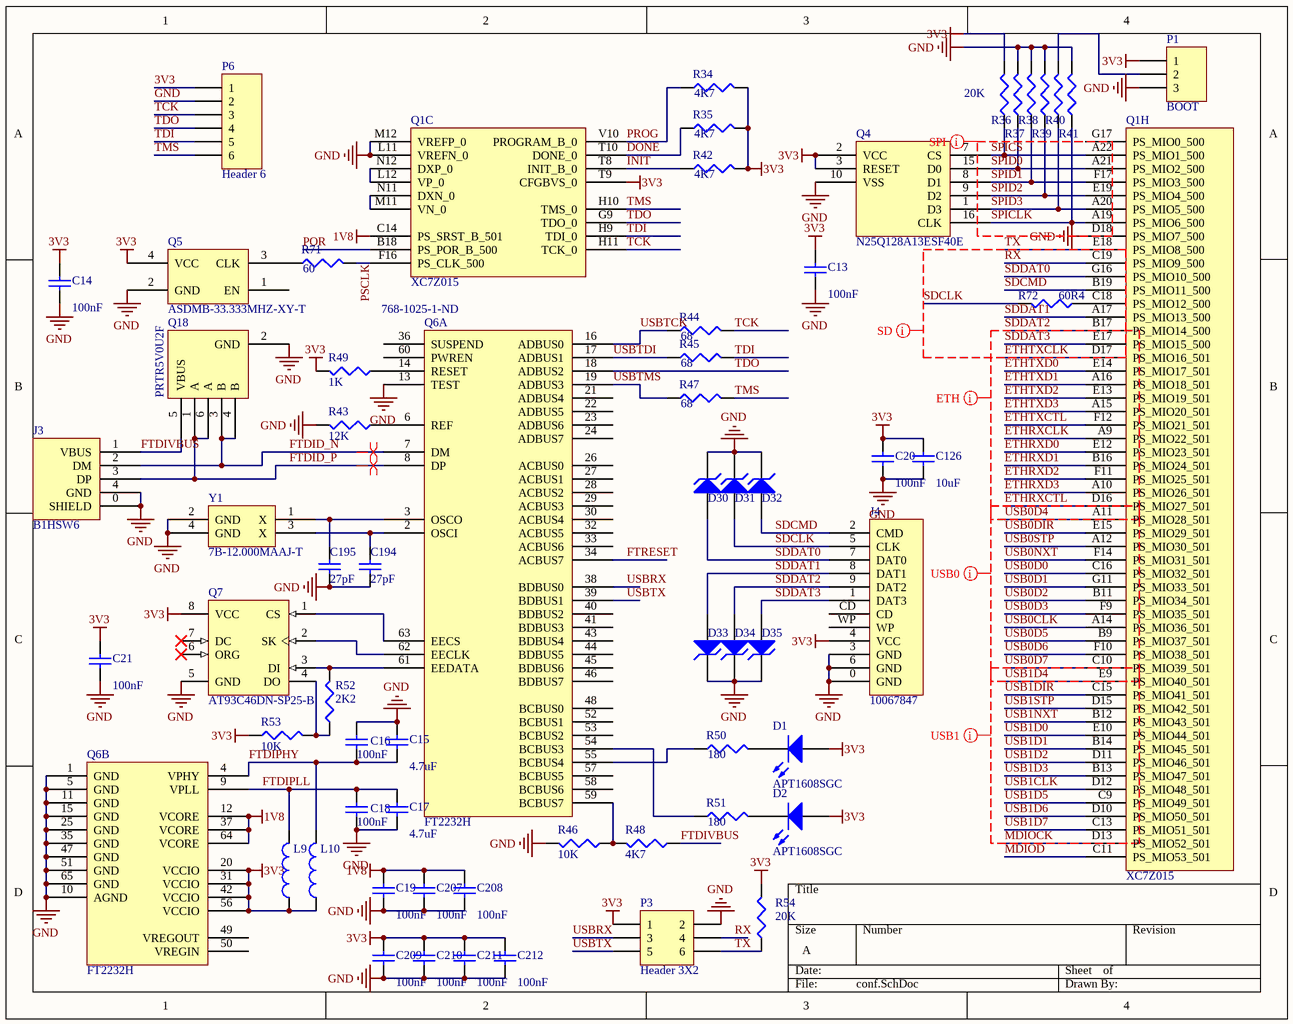
[diagram p3: conf.SchDoc]

### Parts
C13  value 100nF  [CAPC1005X06L]  (hidden comment: Cap)
C14  value 100nF  [CAPC1005X06L]  (hidden comment: Cap)
C15  value 4.7uF  [CAPC1608X90N]  (hidden comment: GRM188R60J475ME19D)
C16  value 100nF  [CAPC1005X06L]  (hidden comment: Cap)
C17  value 4.7uF  [CAPC1608X90N]  (hidden comment: GRM188R60J475ME19D)
C18  value 100nF  [CAPC1005X06L]  (hidden comment: Cap)
C19  value 100nF  [CAPC1005X06L]  (hidden comment: Cap)
C20  value 100nF  [CAPC1005X06L]  (hidden comment: Cap)
C21  value 100nF  [CAPC1005X06L]  (hidden comment: Cap)
C126  value 10uF  [CAPC1608X90N]  (hidden comment: GRM188R60G106ME47)
C194  value 27pF  [CAPC1608X90N]  (hidden comment: CL10C270JB8NNNC)
C195  value 27pF  [CAPC1608X90N]  (hidden comment: CL10C270JB8NNNC)
C207  value 100nF  [CAPC1005X06L]  (hidden comment: Cap)
C208  value 100nF  [CAPC1005X06L]  (hidden comment: Cap)
C209  value 100nF  [CAPC1005X06L]  (hidden comment: Cap)
C210  value 100nF  [CAPC1005X06L]  (hidden comment: Cap)
C211  value 100nF  [CAPC1005X06L]  (hidden comment: Cap)
C212  value 100nF  [CAPC1005X06L]  (hidden comment: Cap)
D1  APT1608SGC  [LED-0603]
D2  APT1608SGC  [LED-0603]
D30  EZAEG2A  [CAPC1005X55N]  (value not drawn)
D31  EZAEG2A  [CAPC1005X55N]  (value not drawn)
D32  EZAEG2A  [CAPC1005X55N]  (value not drawn)
D33  EZAEG2A  [CAPC1005X55N]  (value not drawn)
D34  EZAEG2A  [CAPC1005X55N]  (value not drawn)
D35  EZAEG2A  [CAPC1005X55N]  (value not drawn)
J3  B1HSW6  [USB-B1HSW6]
J4  10067847  [SD-10067847]
L9  BLM18SG121TN1  [CAPC1608X90N]  (value not drawn)
L10  BLM18SG121TN1  [CAPC1608X90N]  (value not drawn)
P1  BOOT  [HDR1X3]
P3  Header 3X2  [HDR2X3]
P6  Header 6  [HDR1X6]
Q1  XC7Z015  [BGA484x22]  (parts C,H of 9)
Q4  N25Q128A13ESF40E  [SOP127P1030X265-16N]
Q5  ASDMB-33.333MHZ-XY-T  [ASDMB]
Q6  FT2232H  Supplier Part Number 1: 768-1025-1-ND  [FT2232H]  (parts A,B of 2)
Q7  AT93C46DN-SP25-B  [8S1_N]
Q18  PRTR5V0U2F  [SOT886]
R34  value 4K7  [J1-0603]  (hidden comment: RC1608J472CS)
R35  value 4K7  [J1-0603]  (hidden comment: RC1608J472CS)
R36  value 20K  [J1-0603]  (hidden comment: RC1608F203CS)
R37  RC1608F203CS  [J1-0603]  (value not drawn)
R38  RC1608F203CS  [J1-0603]  (value not drawn)
R39  RC1608F203CS  [J1-0603]  (value not drawn)
R40  RC1608F203CS  [J1-0603]  (value not drawn)
R41  RC1608F203CS  [J1-0603]  (value not drawn)
R42  value 4K7  [J1-0603]  (hidden comment: RC1608J472CS)
R43  value 12K  [J1-0603]  (hidden comment: RC1608F123CS)
R44  value 68  [J1-0603]  (hidden comment: RC1608J680CS)
R45  value 68  [J1-0603]  (hidden comment: RC1608J680CS)
R46  value 10K  [J1-0603]  (hidden comment: RC1608F103CS)
R47  value 68  [J1-0603]  (hidden comment: RC1608J680CS)
R48  value 4K7  [J1-0603]  (hidden comment: RC1608J472CS)
R49  value 1K  [J1-0603]  (hidden comment: RC1608J102CS)
R50  value 180  [J1-0603]  (hidden comment: RC1608J181CS)
R51  value 180  [J1-0603]  (hidden comment: RC1608J181CS)
R52  value 2K2  [J1-0603]  (hidden comment: RC1608J222CS)
R53  value 10K  [J1-0603]  (hidden comment: RC1608F103CS)
R54  value 20K  [J1-0603]  (hidden comment: RC1608F203CS)
R71  value 60  [J1-0603]  (hidden comment: RC1608F60R4CS)
R72  value 60R4  [CAPC1005X06L]  (hidden comment: RC1005F60R4CS)
Y1  7B-12.000MAAJ-T  [XTAL]

### Nets
1V8: C19.1 C207.1 C208.1 Q1.C14(PS_SRST_B_501) Q6.12(VCORE) Q6.37(VCORE) Q6.64(VCORE)
3V3: C13.2 C14.2 C20.2 C21.1 C126.2 C209.1 C210.1 C211.1 C212.1 D1.A D2.A J4.4(VCC) L9.1 L10.1 P1.1 P3.1 P6.1 Q1.T9(CFGBVS_0) Q4.2(VCC) Q4.3(RESET) Q5.4(VCC) Q6.20(VCCIO) Q6.31(VCCIO) Q6.42(VCCIO) Q6.56(VCCIO) Q7.8(VCC) R34.2 R35.2 R36.2 R42.2 R49.2 R53.1 R54.2
GND: C13.1 C14.1 C15.2 C16.2 C17.1 C18.1 C19.2 C20.1 C21.2 C126.1 C194.2 C195.1 C207.2 C208.2 C209.2 C210.2 C211.2 C212.2 D30.2(K) D31.2(K) D32.2(K) D33.2(K) D34.2(K) D35.2(K) J3.0(SHIELD) J3.4(GND) J4.0(GND) J4.3(GND) J4.6(GND) P1.3 P3.2 P6.2 Q1.D18(PS_MIO7_500) Q1.L11(VREFN_0) Q1.M12(VREFP_0) Q4.10(VSS) Q5.2(GND) Q6.1(GND) Q6.5(GND) Q6.10(AGND) Q6.11(GND) Q6.13(TEST) Q6.15(GND) Q6.25(GND) Q6.35(GND) Q6.47(GND) Q6.51(GND) Q6.65(GND) Q7.5(GND) Q18.2(GND) R37.2 R38.2 R39.2 R41.2 R43.2 R46.2 Y1.2(GND) Y1.4(GND)
DONE: Q1.T10(DONE_0) R35.1
ETHRXCLK: Q1.A9(PS_MIO22_501)
ETHRXCTL: Q1.D16(PS_MIO27_501)
ETHRXD0: Q1.E12(PS_MIO23_501)
ETHRXD1: Q1.B16(PS_MIO24_501)
ETHRXD2: Q1.F11(PS_MIO25_501)
ETHRXD3: Q1.A10(PS_MIO26_501)
ETHTXCLK: Q1.D17(PS_MIO16_501)
ETHTXCTL: Q1.F12(PS_MIO21_501)
ETHTXD0: Q1.E14(PS_MIO17_501)
ETHTXD1: Q1.A16(PS_MIO18_501)
ETHTXD2: Q1.E13(PS_MIO19_501)
ETHTXD3: Q1.A15(PS_MIO20_501)
FTDID_N: J3.2(DM) Q6.7(DM) Q18.3(B) Q18.4(B)
FTDID_P: J3.3(DP) Q6.8(DP) Q18.1(A) Q18.6(A)
FTDIPHY: C15.1 C16.1 L10.2 Q6.4(VPHY)
FTDIPLL: C17.2 C18.2 L9.2 Q6.9(VPLL)
FTDIVBUS: J3.1(VBUS) Q18.5(VBUS) R48.1
FTRESET: Q6.34(ACBUS7)
INIT: Q1.T8(INIT_B_0) R42.1
MDIOCK: Q1.D13(PS_MIO52_501)
MDIOD: Q1.C11(PS_MIO53_501)
POR: Q1.B18(PS_POR_B_500)
PROG: Q1.V10(PROGRAM_B_0) R34.1
PSCLK: Q1.F16(PS_CLK_500) R71.2
RX: P3.4 Q1.C19(PS_MIO9_500)
SDCLK: D31.1(A) J4.5(CLK) R72.2
SDCMD: D32.1(A) J4.2(CMD) Q1.B19(PS_MIO11_500)
SDDAT0: D30.1(A) J4.7(DAT0) Q1.G16(PS_MIO10_500)
SDDAT1: D33.1(A) J4.8(DAT1) Q1.A17(PS_MIO13_500)
SDDAT2: D34.1(A) J4.9(DAT2) Q1.B17(PS_MIO14_500)
SDDAT3: D35.1(A) J4.1(DAT3) Q1.E17(PS_MIO15_500)
SPICLK: Q1.A19(PS_MIO6_500) Q4.16(CLK) R41.1
SPICS: Q1.A22(PS_MIO1_500) Q4.7(CS) R36.1
SPID0: Q1.A21(PS_MIO2_500) Q4.15(D0) R37.1
SPID1: Q1.F17(PS_MIO3_500) Q4.8(D1) R38.1
SPID2: Q1.E19(PS_MIO4_500) Q4.9(D2) R39.1
SPID3: Q1.A20(PS_MIO5_500) Q4.1(D3) R40.1
TCK: P6.3 Q1.H11(TCK_0) R44.2
TDI: P6.5 Q1.H9(TDI_0) R45.2
TDO: P6.4 Q1.G9(TDO_0) Q6.18(ADBUS2)
TMS: P6.6 Q1.H10(TMS_0) R47.2
TX: P3.6 Q1.E18(PS_MIO8_500) R54.1
USB0CLK: Q1.A14(PS_MIO36_501)
USB0D0: Q1.C16(PS_MIO32_501)
USB0D1: Q1.G11(PS_MIO33_501)
USB0D2: Q1.B11(PS_MIO34_501)
USB0D3: Q1.F9(PS_MIO35_501)
USB0D4: Q1.A11(PS_MIO28_501)
USB0D5: Q1.B9(PS_MIO37_501)
USB0D6: Q1.F10(PS_MIO38_501)
USB0D7: Q1.C10(PS_MIO39_501)
USB0DIR: Q1.E15(PS_MIO29_501)
USB0NXT: Q1.F14(PS_MIO31_501)
USB0STP: Q1.A12(PS_MIO30_501)
USB1CLK: Q1.D12(PS_MIO48_501)
USB1D0: Q1.E10(PS_MIO44_501)
USB1D1: Q1.B14(PS_MIO45_501)
USB1D2: Q1.D11(PS_MIO46_501)
USB1D3: Q1.B13(PS_MIO47_501)
USB1D4: Q1.E9(PS_MIO40_501)
USB1D5: Q1.C9(PS_MIO49_501)
USB1D6: Q1.D10(PS_MIO50_501)
USB1D7: Q1.C13(PS_MIO51_501)
USB1DIR: Q1.C15(PS_MIO41_501)
USB1NXT: Q1.B12(PS_MIO43_501)
USB1STP: Q1.D15(PS_MIO42_501)
USBRX: P3.3 Q6.38(BDBUS0)
USBTCK: Q6.16(ADBUS0) R44.1
USBTDI: Q6.17(ADBUS1) R45.1
USBTMS: Q6.19(ADBUS3) R47.1
USBTX: P3.5 Q6.39(BDBUS1)
NetC194_1: C194.1 Q6.2(OSCI) Y1.3(X)
NetC195_2: C195.2 Q6.3(OSCO) Y1.1(X)
NetD1_K: D1.K R50.2
NetD2_K: D2.K R51.2
NetP1_2: P1.2 R40.2
NetQ1_C18: Q1.C18(PS_MIO12_500) R72.1
NetQ1_L12: Q1.L12(VP_0) Q1.N12(DXP_0)
NetQ1_M11: Q1.M11(VN_0) Q1.N11(DXN_0)
NetQ5_3: Q5.3(CLK) R71.1
NetQ6_6: Q6.6(REF) R43.1
NetQ6_14: Q6.14(RESET) R49.1
NetQ6_54: Q6.54(BCBUS3) R51.1
NetQ6_55: Q6.55(BCBUS4) R50.1
NetQ6_59: Q6.59(BCBUS7) R46.1 R48.2
NetQ6_61: Q6.61(EEDATA) Q7.3(DI) R52.2
NetQ6_62: Q6.62(EECLK) Q7.2(SK)
NetQ6_63: Q6.63(EECS) Q7.1(CS)
NetQ7_4: Q7.4(DO) R52.1 R53.2

Not connected (* = marked no-connect by the designer): J4 CD WP; Q1 G17(PS_MIO0_500); Q5 1(EN); Q6 21(ADBUS4) 22(ADBUS5) 23(ADBUS6) 24(ADBUS7) 26(ACBUS0) 27(ACBUS1) 28(ACBUS2) 29(ACBUS3) 30(ACBUS4) 32(ACBUS5) 33(ACBUS6) 36(SUSPEND) 40(BDBUS2) 41(BDBUS3) 43(BDBUS4) 44(BDBUS5) 45(BDBUS6) 46(BDBUS7) 48(BCBUS0) 49(VREGOUT) 50(VREGIN) 52(BCBUS1) 53(BCBUS2) 57(BCBUS5) 58(BCBUS6) 60(PWREN); Q7 6(ORG)* 7(DC)*

### Layout directives
net class SD: ETHTXCLK, RX, SDCLK, SDCMD, SDDAT0, SDDAT1, SDDAT2, SDDAT3, TX
net class ETH: ETHRXCLK, ETHRXCTL, ETHRXD0, ETHRXD1, ETHRXD2, ETHRXD3, ETHTXCLK, ETHTXCTL, ETHTXD0, ETHTXD1, ETHTXD2, ETHTXD3, SDDAT2, SDDAT3, USB0D4
net class USB0: ETHRXCTL, USB0CLK, USB0D0, USB0D1, USB0D2, USB0D3, USB0D4, USB0D5, USB0D6, USB0D7, USB0DIR, USB0NXT, USB0STP, USB1D4
net class USB1: MDIOCK, USB0D7, USB1CLK, USB1D0, USB1D1, USB1D2, USB1D3, USB1D4, USB1D5, USB1D6, USB1D7, USB1DIR, USB1NXT, USB1STP
net class SPI: GND, SPICLK, SPICS, SPID0, SPID1, SPID2, SPID3
differential pair: FTDID_N, FTDID_P

### Library data of the parts
C13-C21 C126 C194 C195 C207-C212 = Cap: Capacitor; Published: 8-Jun-2000; LatestRevisionDate: 17-Jul-2002; LatestRevisionNote: Re-released for DXP Platform.; PackageReference: RAD-0.3; Publisher: Altium Limited; PackageDescription: Radial Cap, Thru-Hole; 2 Leads; 0.3 in Pin Spacing; Supplier 1: Digi-Key
  C13 C14 C16 C18-C21 C207-C212: Supplier Part Number 1: 1276-1443-1-ND
  C15 C17: Supplier Part Number 1: 490-5421-1-ND
  C126: Supplier Part Number 1: 490-3298-1-ND
  C194 C195: Supplier Part Number 1: 1276-1086-1-ND
D1 D2 = LED2: as D9 on sheet misc; Published: 8-Jun-2000; LatestRevisionDate: 17-Jul-2002; LatestRevisionNote: Re-released for DXP Platform.; PackageVersion: Feb-2002; PackageReference: 3.2X1.6X1.1; Publisher: Altium Limited; PackageDescription: SM LED; 2 Flat Leads; Supplier 1: Digi-Key; Supplier Part Number 1: 754-1121-1-ND
D30-D35 = D Zener: Zener Diode; Published: 8-Jun-2000; LatestRevisionDate: 17-Jul-2002; LatestRevisionNote: Re-released for DXP Platform.; PackageReference: DIODE-0.7; Publisher: Altium Limited; PackageDescription: Diode, Thru-Hole; 2 Leads; 0.7 in Pin Spacing; Supplier 1: Digi-Key; Supplier Part Number 1: P13571CT-ND
J3 = USB: Supplier 1: Digi-Key; Supplier Part Number 1: ED2982-ND
J4 = SDCARD: Supplier 1: Digi-Key; Supplier Part Number 1: 609-3956-1-ND
L9 L10 = Inductor: Code_IEC: 1005; Value: 10mH; Published: 8-Jun-2000; LatestRevisionDate: 29-May-2009; LatestRevisionNote: IPC-7351 Footprint Added.; PackageReference: 0402-A; Publisher: Altium Limited; PackageDescription: Chip Inductor; Code_JEITA: 0402; Supplier 1: Digi-Key; Supplier Part Number 1: 490-3996-1-ND
P1 = Header 3: Header, 3-Pin; LatestRevisionDate: 17-Jul-2002; LatestRevisionNote: Re-released for DXP Platform.; Publisher: Altium Limited
P3 = Header 3X2: Header, 3-Pin, Dual row; LatestRevisionDate: 17-Jul-2002; LatestRevisionNote: Re-released for DXP Platform.; Publisher: Altium Limited
P6 = Header 6: Header, 6-Pin; LatestRevisionDate: 17-Jul-2002; LatestRevisionNote: Re-released for DXP Platform.; Publisher: Altium Limited
Q4 = QUADSPI: Supplier 1: Digi-Key; Supplier Part Number 1: 557-1563-ND
Q5 = osc: Supplier 1: Digi-Key; Supplier Part Number 1: 535-11143-1-ND
Q7 = AT93C46DN-SP25-B: 1Kbit (128 x 8 or 64 x 16), 3-wire Bus Serial Automotive EEPROM, 2.5V, 8-Pin SOIC, Bulk; Published: 20-Sep-2010; DatasheetVersion: 8674B,  Oct-2009; PackageVersion: revC, Mar-2005; PackageReference: 8S1; Publisher: Altium Limited; PackageDescription: 8-Lead (0.150" Wide Body), Plastic Gull Wing Small Outline (JEDEC SOIC); Code_JEDEC: MS-012-AA; Code_IPC: SOIC127P600-8; ComponentLink1Description: Manufacturer Link; ComponentLink1URL: http://www.atmel.com/products/serial/default.asp; ComponentLink2Description: Datasheet; ComponentLink2URL: http://www.atmel.com/dyn/resources/prod_documents/doc8674.pdf; ComponentLink3Description: Atmel.com Home; ComponentLink3URL: http://www.atmel.com; Supplier 1: Digi-Key; Supplier Part Number 1: AT93C46DN-SH-B-ND
R34-R36 R42-R54 R71 R72 = Res3: Resistor; Published: 8-Jun-2000; LatestRevisionDate: 29-May-2009; LatestRevisionNote: IPC-7351 Footprint Added.; PackageReference: J1-0603; PackageDescription: Chip Resistor; Supplier 1: Digi-Key
  R34 R35 R42: Publisher: Altium Limited; Supplier Part Number 1: 1276-5078-1-ND
  R36 R54: Publisher: Altium Limited; Supplier Part Number 1: 1276-4768-1-ND
  R43: Supplier Part Number 1: 1276-4750-1-ND
  R44 R45 R47: Publisher: Altium Limited; Supplier Part Number 1: 1276-5034-1-ND
  R46 R53: Publisher: Altium Limited; Supplier Part Number 1: 1276-3485-1-ND
  R48: Supplier Part Number 1: 1276-5078-1-ND
  R49: Supplier Part Number 1: 1276-5062-1-ND
  R50 R51: Publisher: Altium Limited; Supplier Part Number 1: 1276-5044-1-ND
  R52: Publisher: Altium Limited; Supplier Part Number 1: 1276-5070-1-ND
  R71: Supplier Part Number 1: 1276-4547-1-ND
  R72: Publisher: Altium Limited; Supplier Part Number 1: 1276-3929-1-ND
R37-R41 = Res3: Resistor; Value: 20K; Published: 8-Jun-2000; LatestRevisionDate: 29-May-2009; LatestRevisionNote: IPC-7351 Footprint Added.; PackageReference: J1-0603; Publisher: Altium Limited; PackageDescription: Chip Resistor; Supplier 1: Digi-Key; Supplier Part Number 1: 1276-4768-1-ND
Y1 = XTAL: Supplier 1: Digi-Key; Supplier Part Number 1: 887-1099-1-ND
Q1 = XC7Z015: Supplier 1: Digi-Key; Supplier Part Number 1: 122-1905-ND
Q6 = FT2232H: Supplier 1: Digi-Key
Q18 = PRTR5V0U2F: Supplier 1: Digi-Key; Supplier Part Number 1: 568-4677-1-ND